# Altium schematic sheet single-channel_EEG_FrontEnd.SchDoc
size A4
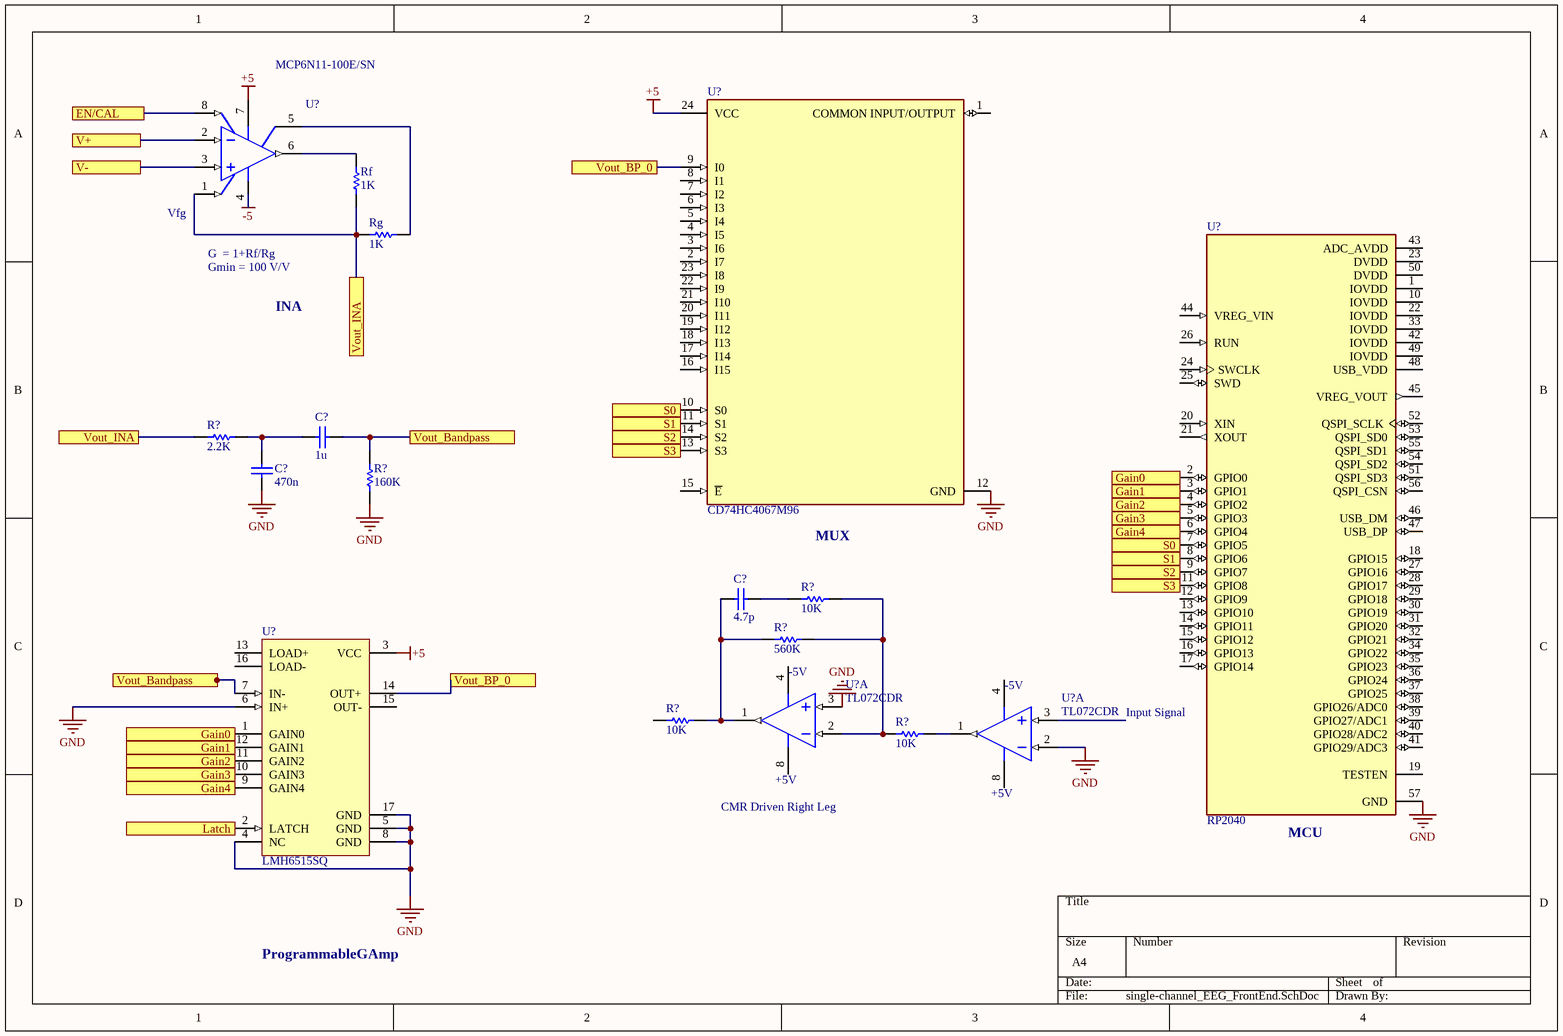
[diagram p0: single-channel_EEG_FrontEnd.SchDoc]

## Parts
(Parts that share a designator on the sheet are numbered #1, #2 ... from top to bottom, then left to right.)
C?#1  value 1u  (hidden comment: Capacitor)
C?#2  value 470n  (hidden comment: Capacitor)
C?#3  value 4.7p  (hidden comment: Capacitor)
R?#1  value 2.2K  (hidden comment: Resistor)
R?#2  value 160K  (hidden comment: Resistor)
R?#3  value 10K  (hidden comment: Resistor)
R?#4  value 560K  (hidden comment: Resistor)
R?#5  value 10K  (hidden comment: Resistor)
R?#6  value 10K  (hidden comment: Resistor)
Rf  value 1K  (hidden comment: Resistor)
Rg  value 1K  (hidden comment: Resistor)
U?#1  CD74HC4067M96  [FP-DW0024A-MFG]
U?#2  MCP6N11-100E/SN  [SOIC-SN8_N]
U?#3  RP2040  [QFN40P700X700X90-57N]
U?#4  LMH6515SQ  [SQA16A]
U?#5  TL072CDR  [D0008A_M]  (part A of 2)
U?#6  TL072CDR  [D0008A_M]  (part A of 2)

## Ports
EN/CAL, Gain0, Gain1, Gain2, Gain3, Gain4, Latch, S0, S1, S2, S3, V+, V-, Vout_Bandpass, Vout_BP_0, Vout_INA

## Nets
+5: U?#1.24(VCC) U?#2.7(VDD) U?#4.3(VCC)
-5: U?#2.4(VSS)
GND: C?#2.1 R?#2.1 U?#1.12(GND) U?#3.57(GND) U?#4.4(NC) U?#4.5(GND) U?#4.6(IN+) U?#4.8(GND) U?#4.17(GND) U?#5.3(IN1+) U?#6.2(IN1-)
EN/CAL: U?#2.8(EN/~{CAL}) ; port EN/CAL
Gain0: U?#3.2(GPIO0) U?#4.1(GAIN0) ; port Gain0
Gain1: U?#3.3(GPIO1) U?#4.12(GAIN1) ; port Gain1
Gain2: U?#3.4(GPIO2) U?#4.11(GAIN2) ; port Gain2
Gain3: U?#3.5(GPIO3) U?#4.10(GAIN3) ; port Gain3
Gain4: U?#3.6(GPIO4) U?#4.9(GAIN4) ; port Gain4
Latch: U?#4.2(LATCH) ; port Latch
S0: U?#1.10(S0) U?#3.7(GPIO5) ; port S0
S1: U?#1.11(S1) U?#3.8(GPIO6) ; port S1
S2: U?#1.14(S2) U?#3.9(GPIO7) ; port S2
S3: U?#1.13(S3) U?#3.11(GPIO8) ; port S3
V+: U?#2.2(VIM) ; port V+
V-: U?#2.3(VIP) ; port V-
Vout_Bandpass: C?#1.1 R?#2.2 U?#4.7(IN-) ; port Vout_Bandpass
Vout_BP_0: U?#1.9(I0) U?#4.14(OUT+) ; port Vout_BP_0
Vout_INA: R?#1.1 Rf.1 Rg.2 U?#2.1(VFG) ; port Vout_INA
NetC?#1_2: C?#1.2 C?#2.2 R?#1.2
NetC?#3_1: C?#3.1 R?#4.1 R?#5.2 U?#5.1(OUT1)
NetC?#3_2: C?#3.2 R?#3.1
NetR?#3_2: R?#3.2 R?#4.2 R?#6.1 U?#5.2(IN1-)
NetR?#6_2: R?#6.2 U?#6.1(OUT1)
NetRf_2: Rf.2 U?#2.6(VOUT)
NetRg_1: Rg.1 U?#2.5(VREF)

Not connected (* = marked no-connect by the designer): R?#5 1; U?#1 1(COMMON_INPUT/OUTPUT) 2(I7) 3(I6) 4(I5) 5(I4) 6(I3) 7(I2) 8(I1) 15(~{E}) 16(I15) 17(I14) 18(I13) 19(I12) 20(I11) 21(I10) 22(I9) 23(I8); U?#3 1(IOVDD) 10(IOVDD) 12(GPIO9) 13(GPIO10) 14(GPIO11) 15(GPIO12) 16(GPIO13) 17(GPIO14) 18(GPIO15) 19(TESTEN) 20(XIN) 21(XOUT) 22(IOVDD) 23(DVDD) 24(SWCLK) 25(SWD) 26(RUN) 27(GPIO16) 28(GPIO17) 29(GPIO18) 30(GPIO19) 31(GPIO20) 32(GPIO21) 33(IOVDD) 34(GPIO22) 35(GPIO23) 36(GPIO24) 37(GPIO25) 38(GPIO26/ADC0) 39(GPIO27/ADC1) 40(GPIO28/ADC2) 41(GPIO29/ADC3) 42(IOVDD) 43(ADC_AVDD) 44(VREG_VIN) 45(VREG_VOUT) 46(USB_DM) 47(USB_DP) 48(USB_VDD) 49(IOVDD) 50(DVDD) 51(QSPI_SD3) 52(QSPI_SCLK) 53(QSPI_SD0) 54(QSPI_SD2) 55(QSPI_SD1) 56(QSPI_CSN); U?#4 13(LOAD+) 15(OUT-) 16(LOAD-); U?#5 4(VCC-) 8(VCC+); U?#6 3(IN1+) 4(VCC-) 8(VCC+)

## Notes on the sheet
- (near U?#2) Vfg
- G  = 1+Rf/Rg
- Gmin = 100 V/V
- INA
- MUX
- (near U?#5) -5V
- (near U?#6) -5V
- (near U?#3) Input Signal
- (near U?#5) +5V
- CMR Driven Right Leg
- (near U?#6) +5V
- (near U?#3) MCU
- ProgrammableGAmp

## Library data of the parts
C?#1-C?#3 = Capacitor: SimulationGenericComponent: True
R?#1-R?#6 Rf Rg = Resistor: TC1: 0; SimulationGenericComponent: True; TC2: 0
U?#1 = CMP-04901-000007-1: IC MUX/DEMUX 1X16 24SOIC; Manufacturer: Texas Instruments; Standoff Height: 0.1mm; Logic Function Desc: Non-Inverting; Max Supply Voltage: 6V; Number Of Inputs: 16; Quiescent Current: 8uA; Number Of Circuits: 1; Propagation Delay: 6ns; Max Junction Temp: +150°C; Min Supply Voltage: 2V; ComponentLink2Description: Datasheet; Octopart: https://octopart.com/cd74hc4067m96-texas+instruments-722802; Ambient Temperature Range High: +125°C; Ipc Land Pattern Name: SOIC127P1030X265-24; Height: 2.65mm; Mouser Description: Multiplexer Switch ICs Hi-Spd CMOS 16Ch Anl Mltplxr/Demltplxr; Temperature Range Low: -55°C; Package: DW0024A; Temperature Range High: +125°C; Lead Free: Yes; ComponentLink2URL: http://www.ti.com/lit/ds/symlink/cd74hc4067.pdf; Manufacturer Part Number: CD74HC4067M96; RoHS: TRUE; Automotive: No; Device Class L1: Integrated Circuits (ICs); Digikey Description: IC MUX/DEMUX 1X16 24SOIC; Device Class L2: Logic ICs; Temperature: -55°C to +125°C; Device Class L3: Multiplexers; Category: IC; Ambient Temperature Range Low: -55°C; Number Of Outputs: 1
U?#2 = CMP-0187-00694-2: None; Number of Circuits: 1; Max Supply Current: 800uA; Unity Gain Bandwidth Product: 35MHz; Number of Elements: 2; Input Bias Current: 10pA; Min Supply Voltage: 1.8V; Bandwidth: 500kHz; Input Offset Voltage (Vos): 350uV; Max Supply Voltage: 5.5V; Common Mode Rejection Ratio: 86dB; Slew Rate: 6V/µs; Slew Rate-Nom: 9V/µs; Height: 1.25mm; REACH SVHC: No SVHC; Number of Pins: 8; Package Quantity: 100; Max Operating Temperature: 125°C; Min Operating Temperature: -40°C; RoHS Compliant: Yes; Width: 3.9mm; Number of Amplifiers: 1; Lead Free: Lead Free; Case/Package: SOIC; Number of Channels: 1; Supply Current: 800uA; Radiation Hardening: No; Length: 4.9mm; Nominal Supply Current: 800uA; Power Supply Rejection Ratio (PSRR): 86dB; Gain Bandwidth Product: 35MHz; Packaging: Rail/Tube; Mount: Surface Mount; Input Offset Voltage-Max: 350uV
U?#3 = RP2040: RP2040 chip for Raspberry Pi Pico - ARM® Cortex®-M0+ MCU 32-Bit; SnapEDA_Link: https://www.snapeda.com/parts/RP2040/Raspberry+Pi/view-part/?ref=snap; Package: None; Value: *; MF: Raspberry Pi; MP: RP2040; Check_prices: https://www.snapeda.com/parts/RP2040/Raspberry+Pi/view-part/?ref=eda
U?#4 = CMP-0055-00291-2: 600 MHz, Digital Controlled, Variable Gain Amplifier, 16-pin LLP; Manufacturer: National Semiconductor; PowerWise: Y; CompType: Amplifiers; PackageTopMarking: NS*UZXYTT*L6515SQ; PinCount: 16; ComponentLink1Description: LMH6515 Datasheet; PackageReference: SQA16A; ComponentLink2Description: LMH6515 Web Page; PackageDescription: LLP, Plastic, Quad, 4 x 4 x 0.8mm Body, 16 Lead, 0.5mm Pitch, No Pullback; ComponentLink1URL: http://www.national.com/ds/LM/LMH6515.pdf; ComponentLink2URL: http://www.national.com/pf/LM/LMH6515.html; ComponentLink3URL: http://www.national.com/packaging/folders/sqa16a.html; PackageVersion: revA, Oct-2003; ComponentLink3Description: SQA16A Package Page; RoHS: Y; RevisionNote: Component URLs added; DatasheetVersion: Oct-2007
U?#5 U?#6 = CMP-0017-00628-2: Dual Low-Noise JFET-Input General-Purpose Operational Amplifier, 7 to 36 V, 0 to 70 degC, 8-pin SOIC (D8), Green (RoHS & no Sb/Br); Manufacturer: Texas Instruments; Total Supply Voltage(Min)(+5V is 5, +/-5V is 10): 7; IIB(Max)(pA): 200; Sub Family: General Purpose Amplifier, High Supply Voltage Amplifier (>=30V); Number of Channels: 2; Iq per channel(Max)(mA): 2.5; Total Supply Voltage(Max)(+5V is 5, +/-5V is 10): 36; Vio (25C)(Max)(mV): 10; Offset Drift(Typ)(uV/C): 18; CMRR(Min)(dB): 70; Rating: Catalog; Slew Rate(Typ)(V/us): 13; GBW(Typ)(MHz): 3; ComponentLink1Description: Manufacturer URL; Code_JEDEC: MS-012; ComponentLink3Description: Package Specification; Mounting Technology: Surface Mount; Eco-Plan: Green (RoHS & no Sb/Br); ComponentLink3URL: http://www.ti.com/litv/pdf/msoi002j; ComponentLink1URL: http://www.ti.com/; PackageVersion: 4040047-3/M, 06/2011; ComponentLink2URL: http://www.ti.com/lit/ds/symlink/tl072.pdf; PartNumber: TL072CDR; PackageDescription: 8-Pin Plastic Small Outline, Body 4.9 x 3.9 mm, Pitch 1.27 mm; DatasheetVersion: SLOS080J; Vn at 1kHz(Typ)(nV/rtHz): 18; ComponentLink2Description: Datasheet; PackageReference: D0008A